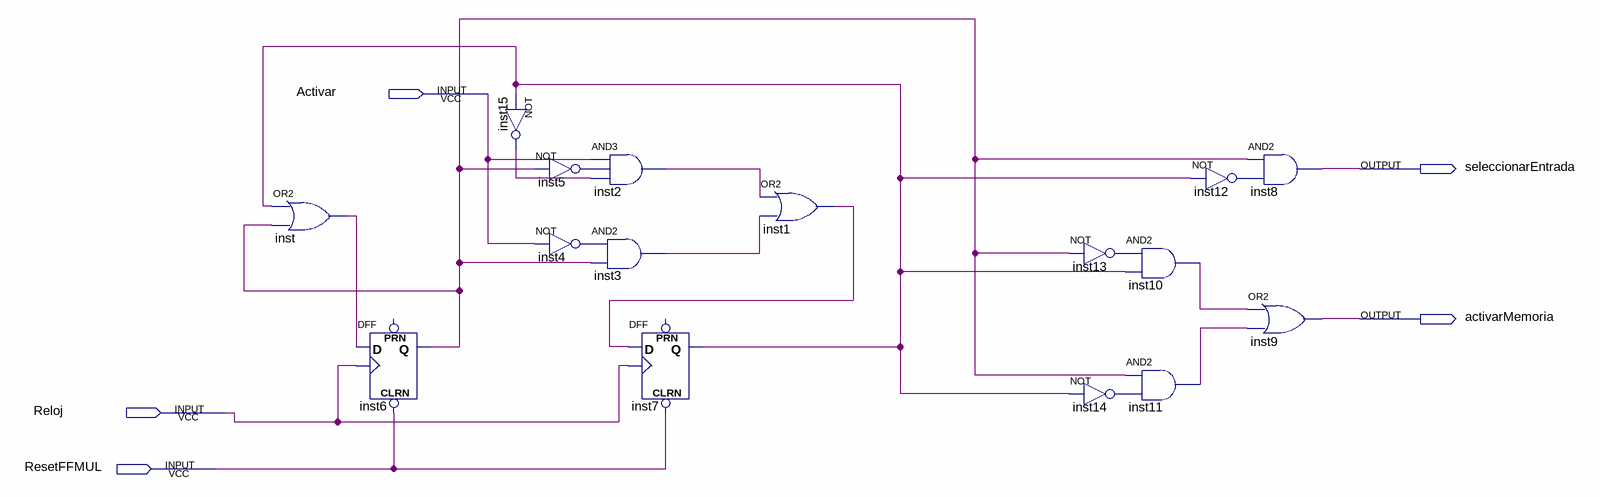
[diagram p0: schematic sheet]
// Quartus schematic MaquinaControlMultiplex.bdf as structural Verilog: 16 symbols, 5 pins
module MaquinaControlMultiplex (
  input  Activar,
  input  Reloj,
  input  ResetFFMUL,
  output seleccionarEntrada,
  output activarMemoria
);

  wire inst1_out, inst2_out, inst3_out, inst4_out, inst5_out, inst6_q, inst7_q, inst10_out, inst11_out,
       inst12_out, inst13_out, inst14_out, inst15_out, inst_out;

  or inst (inst_out, inst7_q, inst6_q);
  DFF inst6 (.CLRN(ResetFFMUL), .CLK(Reloj), .D(inst_out), .Q(inst6_q));  // open: PRN
  not inst15 (inst15_out, inst7_q);
  not inst5 (inst5_out, inst6_q);
  not inst4 (inst4_out, Activar);
  and inst2 (inst2_out, Activar, inst5_out, inst15_out);
  and inst3 (inst3_out, inst4_out, inst6_q);
  DFF inst7 (.CLRN(ResetFFMUL), .CLK(Reloj), .D(inst1_out), .Q(inst7_q));  // open: PRN
  or inst1 (inst1_out, inst2_out, inst3_out);
  not inst13 (inst13_out, inst6_q);
  not inst14 (inst14_out, inst7_q);
  and inst10 (inst10_out, inst13_out, inst7_q);
  and inst11 (inst11_out, inst6_q, inst14_out);
  not inst12 (inst12_out, inst7_q);
  and inst8 (seleccionarEntrada, inst6_q, inst12_out);
  or inst9 (activarMemoria, inst10_out, inst11_out);
endmodule
